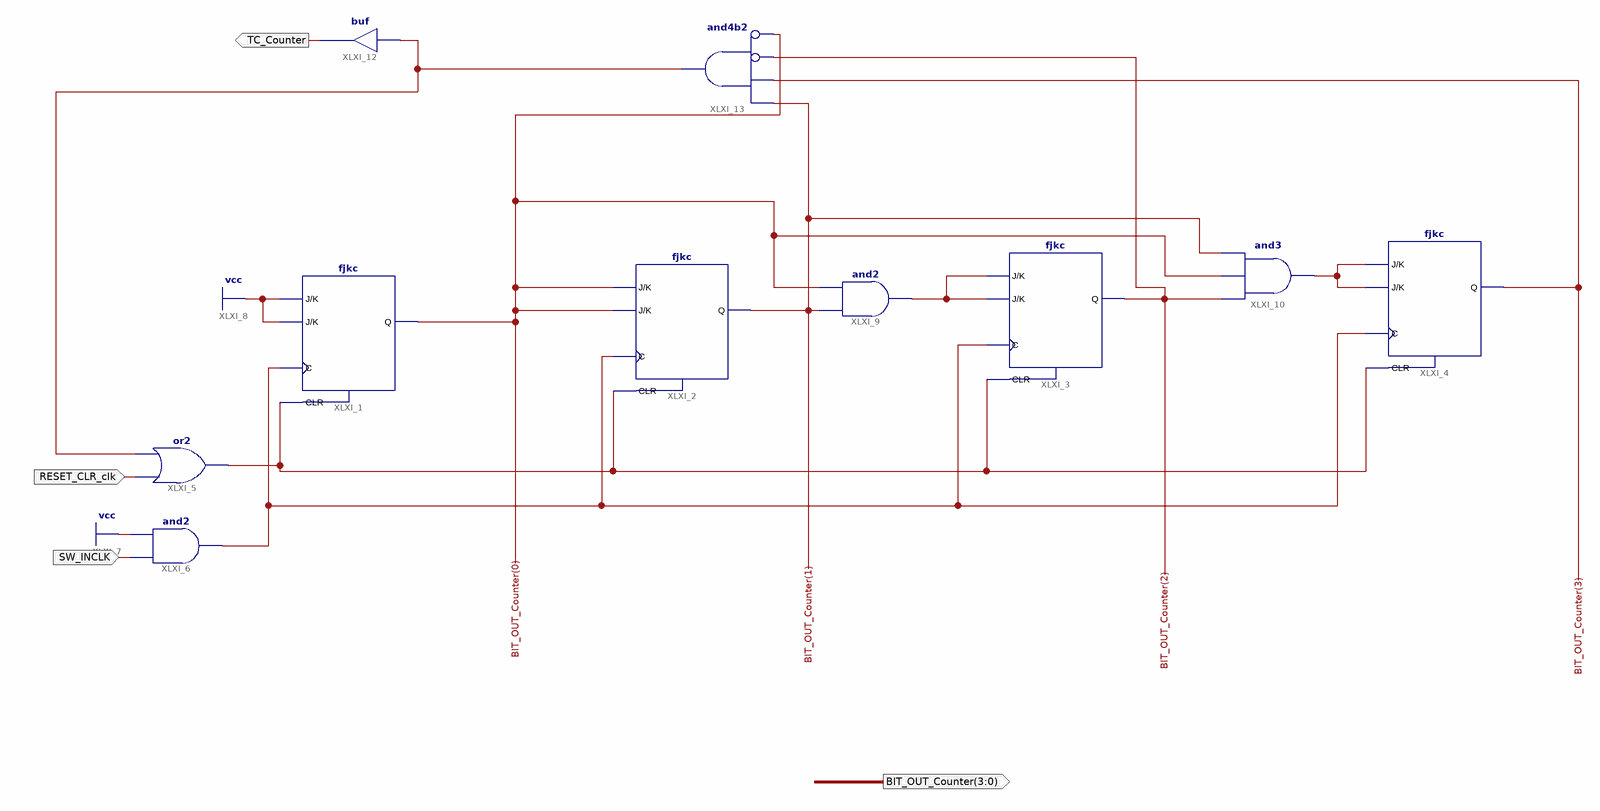
[diagram p0: schematic sheet 1]
// Xilinx ISE schematic Counter0_9_CLR_TC.sch (spartan6) as structural Verilog: 10 symbols, 4 ports
module Counter0_9_CLR_TC (
  input  SW_INCLK,
  input  RESET_CLR_clk,
  output [3:0] BIT_OUT_Counter,
  output TC_Counter
);

  wire XLXN_2, XLXN_10, XLXN_18, XLXN_21, XLXN_27;

  fjkc XLXI_1 (.C(XLXN_10), .CLR(XLXN_2), .J(1'b1), .K(1'b1), .Q(BIT_OUT_Counter[0]));
  fjkc XLXI_2 (.C(XLXN_10), .CLR(XLXN_2), .J(BIT_OUT_Counter[0]), .K(BIT_OUT_Counter[0]), .Q(BIT_OUT_Counter[1]));
  fjkc XLXI_3 (.C(XLXN_10), .CLR(XLXN_2), .J(XLXN_18), .K(XLXN_18), .Q(BIT_OUT_Counter[2]));
  fjkc XLXI_4 (.C(XLXN_10), .CLR(XLXN_2), .J(XLXN_21), .K(XLXN_21), .Q(BIT_OUT_Counter[3]));
  or XLXI_5 (XLXN_2, RESET_CLR_clk, XLXN_27);
  and XLXI_6 (XLXN_10, SW_INCLK, 1'b1);
  and XLXI_9 (XLXN_18, BIT_OUT_Counter[1], BIT_OUT_Counter[0]);
  and XLXI_10 (XLXN_21, BIT_OUT_Counter[2], BIT_OUT_Counter[0], BIT_OUT_Counter[1]);
  buf XLXI_12 (TC_Counter, XLXN_27);
  and XLXI_13 (XLXN_27, ~BIT_OUT_Counter[0], ~BIT_OUT_Counter[2], BIT_OUT_Counter[3], BIT_OUT_Counter[1]);  // and4b2
endmodule
